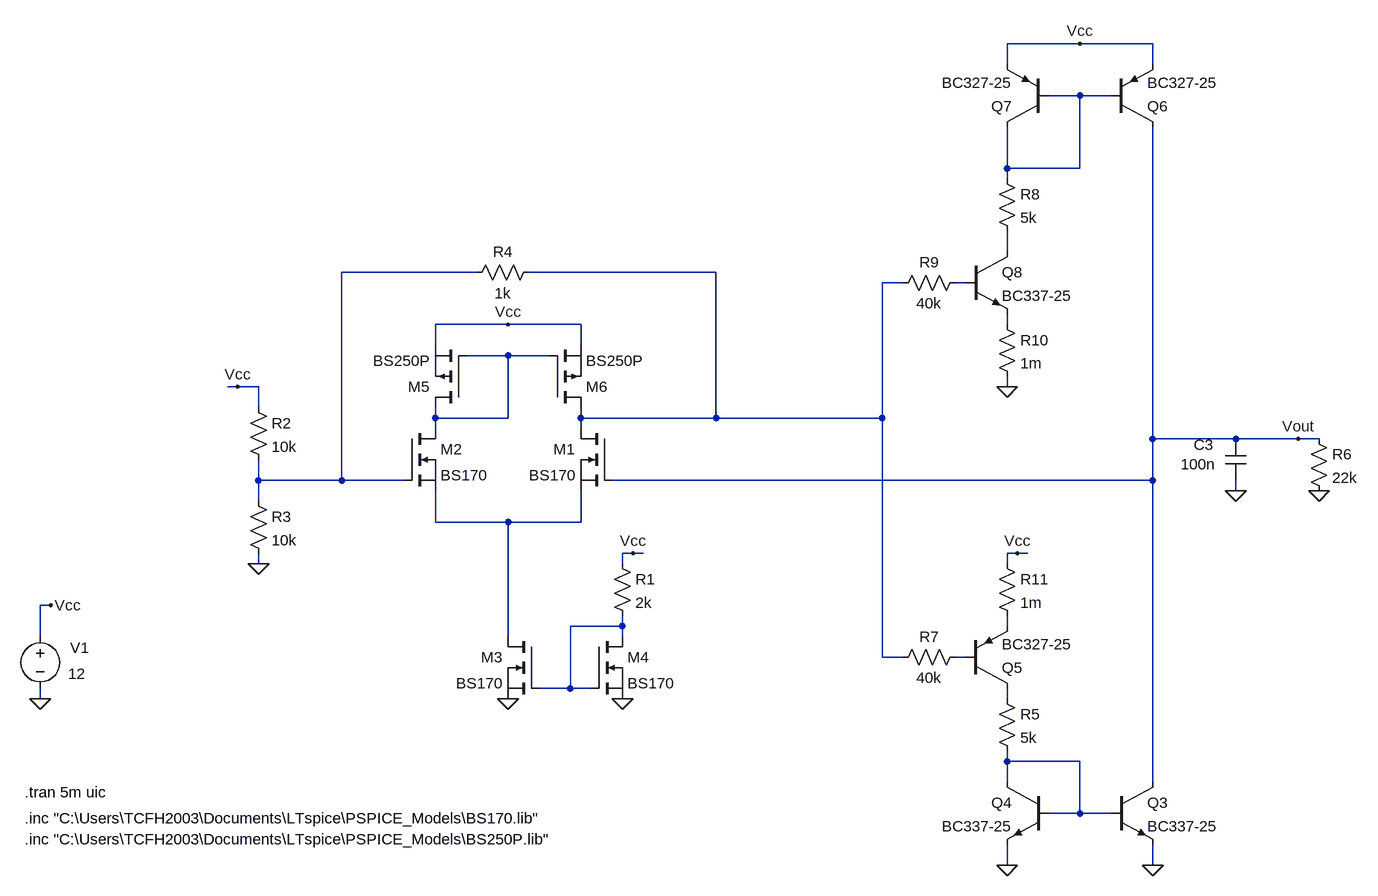
[diagram p0: schematic Proiect1_v3.asc]
Proiect1_v3.asc, the LTspice schematic file:
Version 4
SHEET 1 1956 956
WIRE 1088 -928 976 -928
WIRE 1200 -928 1088 -928
WIRE 976 -896 976 -928
WIRE 1200 -896 1200 -928
WIRE 1088 -848 1040 -848
WIRE 1136 -848 1088 -848
WIRE 976 -736 976 -800
WIRE 1088 -736 1088 -848
WIRE 1088 -736 976 -736
WIRE 976 -720 976 -736
WIRE 976 -608 976 -640
WIRE 160 -576 -48 -576
WIRE 528 -576 240 -576
WIRE 816 -560 784 -560
WIRE 912 -560 896 -560
WIRE 208 -496 96 -496
WIRE 320 -496 208 -496
WIRE 976 -496 976 -512
WIRE 96 -464 96 -496
WIRE 320 -464 320 -496
WIRE 208 -448 144 -448
WIRE 272 -448 208 -448
WIRE -208 -400 -224 -400
WIRE -176 -400 -208 -400
WIRE 976 -400 976 -416
WIRE -176 -368 -176 -400
WIRE 96 -352 96 -368
WIRE 208 -352 208 -448
WIRE 208 -352 96 -352
WIRE 320 -352 320 -368
WIRE 528 -352 528 -576
WIRE 528 -352 320 -352
WIRE 784 -352 784 -560
WIRE 784 -352 528 -352
WIRE 96 -336 96 -352
WIRE 320 -336 320 -352
WIRE 1200 -320 1200 -800
WIRE 1328 -320 1200 -320
WIRE 1424 -320 1328 -320
WIRE 1456 -320 1424 -320
WIRE -176 -256 -176 -288
WIRE -48 -256 -48 -576
WIRE -48 -256 -176 -256
WIRE 48 -256 -48 -256
WIRE 1200 -256 1200 -320
WIRE 1200 -256 368 -256
WIRE 1328 -240 1328 -256
WIRE -176 -224 -176 -256
WIRE 96 -192 96 -240
WIRE 208 -192 96 -192
WIRE 320 -192 320 -240
WIRE 320 -192 208 -192
WIRE 400 -144 384 -144
WIRE 416 -144 400 -144
WIRE 992 -144 976 -144
WIRE 1008 -144 992 -144
WIRE -176 -128 -176 -144
WIRE 384 -128 384 -144
WIRE 976 -128 976 -144
WIRE -496 -64 -512 -64
WIRE 384 -32 384 -48
WIRE 384 -32 304 -32
WIRE 976 -32 976 -48
WIRE -512 -16 -512 -64
WIRE 208 -16 208 -192
WIRE 384 -16 384 -32
WIRE 784 16 784 -352
WIRE 816 16 784 16
WIRE 912 16 896 16
WIRE 304 64 304 -32
WIRE 304 64 256 64
WIRE 336 64 304 64
WIRE -512 80 -512 64
WIRE 976 80 976 64
WIRE 976 176 976 160
WIRE 1088 176 976 176
WIRE 976 208 976 176
WIRE 1200 208 1200 -256
WIRE 1088 256 1088 176
WIRE 1088 256 1040 256
WIRE 1136 256 1088 256
WIRE 976 336 976 304
WIRE 1200 336 1200 304
FLAG -512 80 0
FLAG -496 -64 Vcc
FLAG 976 336 0
FLAG 1200 336 0
FLAG 1328 -240 0
FLAG 1456 -240 0
FLAG 992 -144 Vcc
FLAG 1088 -928 Vcc
FLAG 1424 -320 Vout
FLAG 976 -400 0
FLAG 400 -144 Vcc
FLAG 208 80 0
FLAG 384 80 0
FLAG 208 -496 Vcc
FLAG -176 -128 0
FLAG -208 -400 Vcc
SYMBOL voltage -512 -32 R0
WINDOW 0 46 33 Left 2
WINDOW 3 43 73 Left 2
WINDOW 123 0 0 Left 0
WINDOW 39 0 0 Left 0
SYMATTR InstName V1
SYMATTR Value 12
SYMBOL npn 1136 208 R0
SYMATTR InstName Q3
SYMATTR Value BC337-25
SYMBOL npn 1040 208 M0
SYMATTR InstName Q4
SYMATTR Value BC337-25
SYMBOL res 960 64 R0
SYMATTR InstName R5
SYMATTR Value 5k
SYMBOL cap 1344 -256 R180
WINDOW 0 50 55 Left 2
WINDOW 3 47 25 Left 2
SYMATTR InstName C3
SYMATTR Value 100n
SYMBOL res 1440 -336 R0
SYMATTR InstName R6
SYMATTR Value 22k
SYMBOL pnp 912 64 M180
SYMATTR InstName Q5
SYMATTR Value BC327-25
SYMBOL res 912 0 R90
WINDOW 0 0 56 VBottom 2
WINDOW 3 32 56 VTop 2
SYMATTR InstName R7
SYMATTR Value 40k
SYMBOL pnp 1136 -800 M180
SYMATTR InstName Q6
SYMATTR Value BC327-25
SYMBOL pnp 1040 -800 R180
SYMATTR InstName Q7
SYMATTR Value BC327-25
SYMBOL res 960 -736 R0
SYMATTR InstName R8
SYMATTR Value 5k
SYMBOL npn 912 -608 R0
SYMATTR InstName Q8
SYMATTR Value BC337-25
SYMBOL res 912 -576 R90
WINDOW 0 0 56 VBottom 2
WINDOW 3 32 56 VTop 2
SYMATTR InstName R9
SYMATTR Value 40k
SYMBOL res 960 -512 R0
SYMATTR InstName R10
SYMATTR Value 1m
SYMBOL res 960 -144 R0
SYMATTR InstName R11
SYMATTR Value 1m
SYMBOL nmos 368 -336 M0
SYMATTR InstName M1
SYMATTR Value BS170
SYMBOL nmos 48 -336 R0
SYMATTR InstName M2
SYMATTR Value BS170
SYMBOL nmos 256 -16 M0
SYMATTR InstName M3
SYMATTR Value BS170
SYMBOL nmos 336 -16 R0
SYMATTR InstName M4
SYMATTR Value BS170
SYMBOL res 368 -144 R0
SYMATTR InstName R1
SYMATTR Value 2k
SYMBOL pmos 144 -368 R180
SYMATTR InstName M5
SYMATTR Value BS250P
SYMBOL pmos 272 -368 M180
SYMATTR InstName M6
SYMATTR Value BS250P
SYMBOL res -192 -384 R0
SYMATTR InstName R2
SYMATTR Value 10k
SYMBOL res -192 -240 R0
SYMATTR InstName R3
SYMATTR Value 10k
SYMBOL res 256 -592 R90
WINDOW 0 0 56 VBottom 2
WINDOW 3 32 56 VTop 2
SYMATTR InstName R4
SYMATTR Value 1k
TEXT -536 224 Left 2 !.tran 5m uic
TEXT -536 264 Left 2 !.inc "C:\\Users\\TCFH2003\\Documents\\LTspice\\PSPICE_Models\\BS170.lib"
TEXT -536 296 Left 2 !.inc "C:\\Users\\TCFH2003\\Documents\\LTspice\\PSPICE_Models\\BS250P.lib"

The netlist it stands for:
* Proiect1_v3.asc
V1 Vcc 0 12
Q3 Vout N013 0 0 BC337-25
Q4 N013 N013 0 0 BC337-25
R5 N012 N013 5k
C3 0 Vout 100n
R6 Vout 0 22k
Q5 N012 N011 N010 0 BC327-25
R7 N011 N004 40k
Q6 Vout N001 Vcc 0 BC327-25
Q7 N001 N001 Vcc 0 BC327-25
R8 N001 N002 5k
Q8 N002 N005 N006 0 BC337-25
R9 N005 N004 40k
R10 N006 0 1m
R11 Vcc N010 1m
M1 N004 Vout N008 N008 BS170
M2 N007 N003 N008 N008 BS170
M3 N008 N009 0 0 BS170
M4 N009 N009 0 0 BS170
R1 Vcc N009 2k
M5 N007 N007 Vcc Vcc BS250P
M6 N004 N007 Vcc Vcc BS250P
R2 Vcc N003 10k
R3 N003 0 10k
R4 N004 N003 1k
.model NPN NPN
.model PNP PNP
.lib standard.bjt
.model NMOS NMOS
.model PMOS PMOS
.lib standard.mos
.tran 5m uic
.inc "C:\Users\TCFH2003\Documents\LTspice\PSPICE_Models\BS170.lib"
.inc "C:\Users\TCFH2003\Documents\LTspice\PSPICE_Models\BS250P.lib"
.backanno
.end